# Altium schematic sheet 15-MT7688AN Ethernet-E.SchDoc
size A4
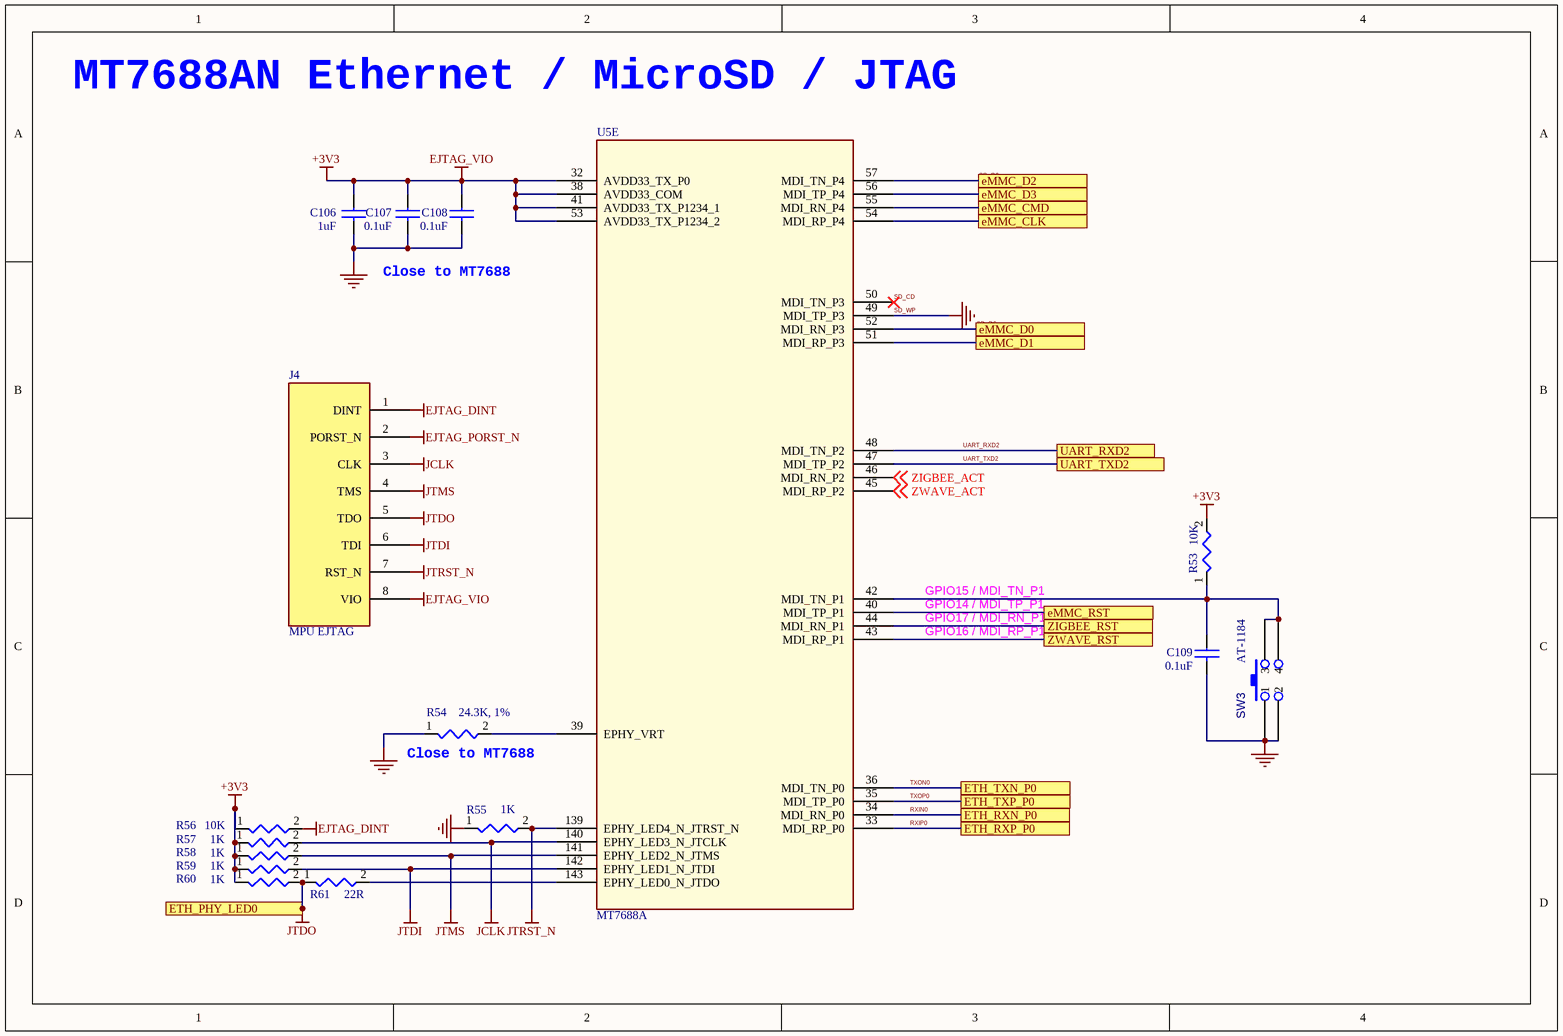
[diagram p0: 15-MT7688AN Ethernet-E.SchDoc]

## Parts
C106  1uF  [CAPC1005X60X30NL05T10]
C107  0.1uF  [CAPC1005X60X30NL05T10]
C108  0.1uF  [CAPC1005X60X30NL05T10]
C109  0.1uF  [CAPC1005X60X30NL05T10]
J4  MPU EJTAG  [MPU EJTAG DEBUG]
R53  10K  [RESC1005X35X25NL10T10]
R54  24.3K, 1%  [RESC1005X35X25NL10T10]
R55  1K  [RESC1005X35X25NL10T10]
R56  10K  [RESC1005X35X25NL10T10]
R57  1K  [RESC1005X35X25NL10T10]
R58  1K  [RESC1005X35X25NL10T10]
R59  1K  [RESC1005X35X25NL10T10]
R60  1K  [RESC1005X35X25NL10T10]
R61  22R  [RESC1005X35X25NL10T10]
SW3  AT-1184  [AT-1184 SW]
U5  MT7688A  [MT7628AN$2F$DRQFN156$2F$SMD$2F$P0.5$2F$12X12]  (part E of 6)

## Ports
eMMC_CLK, eMMC_CMD, eMMC_D0, eMMC_D1, eMMC_D2, eMMC_D3, eMMC_RST, ETH_PHY_LED0, ETH_RXN_P0, ETH_RXP_P0, ETH_TXN_P0, ETH_TXP_P0, UART_RXD2, UART_TXD2, ZIGBEE_RST, ZWAVE_RST

## Nets
+3V3: C106.1 C107.1 C108.1 J4.8(VIO) R53.2 R56.1 R57.1 R58.1 R59.1 R60.1 U5.32(AVDD33_TX_P0) U5.38(AVDD33_COM) U5.41(AVDD33_TX_P1234_1) U5.53(AVDD33_TX_P1234_2)  [also labelled EJTAG_VIO]
EJTAG_DINT: J4.1(DINT) R56.2
EJTAG_PORST_N: J4.2(PORST_N)
JCLK: J4.3(CLK) R57.2 U5.140(EPHY_LED3_N_JTCLK)
JTDI: J4.6(TDI) R59.2 U5.142(EPHY_LED1_N_JTDI)
JTDO: J4.5(TDO) R60.2 R61.1 ; port ETH_PHY_LED0
JTMS: J4.4(TMS) R58.2 U5.141(EPHY_LED2_N_JTMS)
JTRST_N: J4.7(RST_N) R55.2 U5.139(EPHY_LED4_N_JTRST_N)
SD_WP: C106.2 C107.2 C108.2 C109.2 R54.1 R55.1 SW3.1 SW3.2 U5.49(MDI_TP_P3)  [also labelled GND]
GPIO14 / MDI_TP_P1: U5.40(MDI_TP_P1) ; port eMMC_RST
GPIO15 / MDI_TN_P1: C109.1 R53.1 SW3.3 SW3.4 U5.42(MDI_TN_P1)
GPIO16 / MDI_RP_P1: U5.43(MDI_RP_P1) ; port ZWAVE_RST
GPIO17 / MDI_RN_P1: U5.44(MDI_RN_P1) ; port ZIGBEE_RST
RXIN0: U5.34(MDI_RN_P0) ; port ETH_RXN_P0
RXIP0: U5.33(MDI_RP_P0) ; port ETH_RXP_P0
SD_CD: U5.50(MDI_TN_P3)
SD_CLK: U5.54(MDI_RP_P4) ; port eMMC_CLK
SD_CMD: U5.55(MDI_RN_P4) ; port eMMC_CMD
SD_D0: U5.52(MDI_RN_P3) ; port eMMC_D0
SD_D1: U5.51(MDI_RP_P3) ; port eMMC_D1
SD_D2: U5.57(MDI_TN_P4) ; port eMMC_D2
SD_D3: U5.56(MDI_TP_P4) ; port eMMC_D3
TXON0: U5.36(MDI_TN_P0) ; port ETH_TXN_P0
TXOP0: U5.35(MDI_TP_P0) ; port ETH_TXP_P0
UART_RXD2: U5.48(MDI_TN_P2) ; port UART_RXD2
UART_TXD2: U5.47(MDI_TP_P2) ; port UART_TXD2
ZIGBEE_ACT: U5.46(MDI_RN_P2) ; off-sheet ZIGBEE_ACT
ZWAVE_ACT: U5.45(MDI_RP_P2) ; off-sheet ZWAVE_ACT
NetR54_2: R54.2 U5.39(EPHY_VRT)
NetR61_2: R61.2 U5.143(EPHY_LED0_N_JTDO)

## Notes on the sheet
- MT7688AN Ethernet / MicroSD / JTAG
- Close to MT7688
- (near R54) Close to MT7688

## Library data of the parts
C106-C109 = CAP NP
R53-R61 = RES/0402_3
SW3 = SW: TACT Switch, H=1.5mm; Manufacturer: Panasonic - ECG; Manufacturer P/N: EVQ-Q2B01W; Distributor P/N: P12930SCT-ND; Distributor: Digikey
U5 = MT7620N-n_26